# Altium schematic sheet 00_Top_Diseño.SchDoc
size A3; SheetNumber: 18; SheetTotal: 25
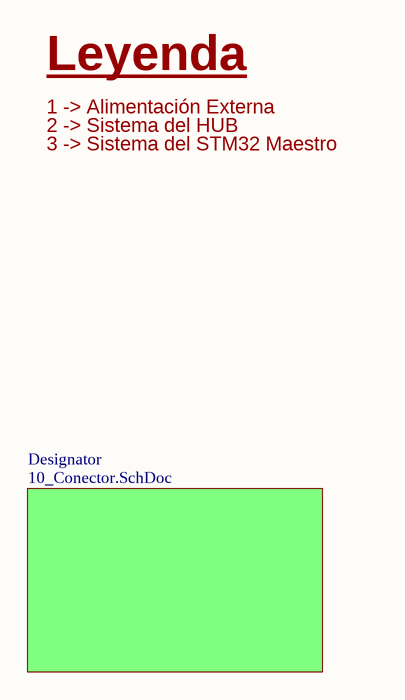
[diagram p0: 00_Top_Diseño.SchDoc]

## Sub-sheets
Designator = 10_Conector.SchDoc: no entries

## Notes on the sheet
- Leyenda
- 1 -> Alimentación Externa
- 2 -> Sistema del HUB
- 3 -> Sistema del STM32 Maestro